# Altium project 地震波采集系统.PrjPcb
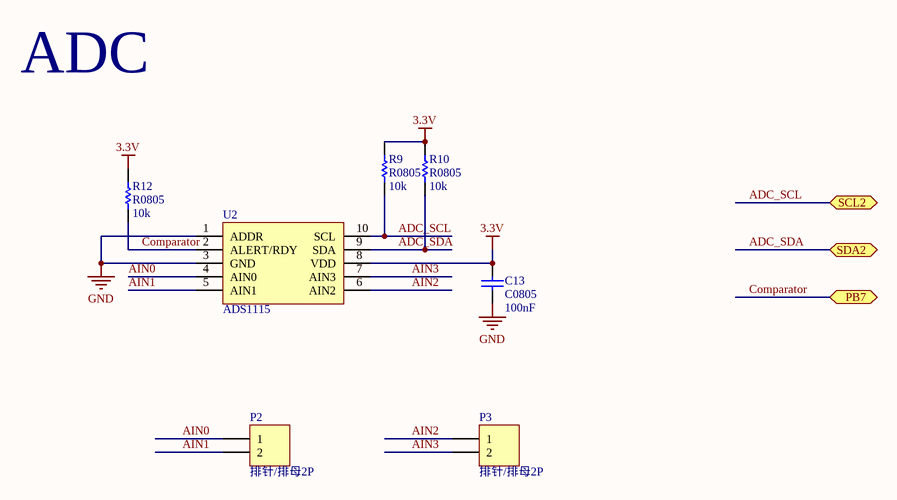
[diagram p0: ADC.SchDoc]
3 sheets, 69 parts. Net scope: flat (ports and power ports of the same name join across sheets).
Board files: PCB1.PcbDoc, PCB2.PcbDoc
Sheets:
  ADC.SchDoc
  Controller.SchDoc
  Power.SchDoc

## Sheet ADC.SchDoc
size A4; SheetNumber: 1; SheetTotal: 3

### Parts
C13  Case/Package: C0805  [C0805_200X125X140L50N]  (hidden comment: 100nF)
P2  排针/排母2P  [HDR1X2]
P3  排针/排母2P  [HDR1X2]
R9  Case/Package: R0805  [R0805_200X125X140L50N]  (hidden comment: 10k)
R10  Case/Package: R0805  [R0805_200X125X140L50N]  (hidden comment: 10k)
R12  Case/Package: R0805  [R0805_200X125X140L50N]  (hidden comment: 10k)
U2  ADS1115  [VSSOP-10_L3.0-W3.0-P0.50-LS4.9-BL]

### Ports
PB7 (bidir), SCL2 (bidir), SDA2 (bidir)

### Nets
3.3V: C13.2 R9.2 R10.2 R12.2 U2.8(VDD)
GND: C13.1 U2.1(ADDR) U2.3(GND)
ADC_SCL: R9.1 U2.10(SCL) ; port SCL2
ADC_SDA: R10.1 U2.9(SDA) ; port SDA2
AIN0: P2.1 U2.4(AIN0)
AIN1: P2.2 U2.5(AIN1)
AIN2: P3.1 U2.6(AIN2)
AIN3: P3.2 U2.7(AIN3)
Comparator: R12.1 U2.2(ALERT/RDY) ; port PB7

### Notes on the sheet
- ADC

### Library data of the parts
C13 = Cap0805: 0805 SMT MLCC Capacitor; Voltage: 50V; Tolerance: 10%; ProductIndex: 11; Published: 8-Jun-2000; LatestRevisionDate: 17-Jul-2002; LatestRevisionNote: Re-released for DXP Platform.; PackageReference: RAD-0.3; Publisher: Altium Limited; PackageDescription: Radial Cap, Thru-Hole; 2 Leads; 0.3 in Pin Spacing; Voltage Rating: 50V; ProductType: Capacitors; Value: 100nF
P2 P3 = Header 2: Header, 2-Pin; LatestRevisionDate: 17-Jul-2002; LatestRevisionNote: Re-released for DXP Platform.; Publisher: Altium Limited
R9 R10 R12 = Res0805: 0805 SMT Resistor; Tolerance: 1%; ProductIndex: 10; Published: 8-Jun-2000; LatestRevisionDate: 17-Jul-2002; LatestRevisionNote: Re-released for DXP Platform.; PackageReference: AXIAL-0.3; Publisher: Altium Limited; PackageDescription: Axial Device, Thru-Hole; 2 Leads; 0.3 in Pin Spacing; ProductType: Resistors; Value: 10k
U2 = ADS1115: ADS111x Ultra-Small, Low-Power, I / 2C-Compatible, 860-SPS, 16-Bit ADCs / With Internal Reference, Oscillator, and Programmable Comparator; Manufacturer: TI; ProductIndex: 0; ProductType: Integrated Circuits; Case/Package: SOP10; ComponentLink1Description: Datasheet; ComponentLink1URL: https://www.ti.com/lit/ds/symlink/ads1115.pdf; Value: ADS1115

## Sheet Controller.SchDoc: 地震波采集系统
size A4; Author: Jingxiang Wang; Engineer: Jingxiang Wang; Organization: UESTC; SheetNumber: 2; SheetTotal: 3
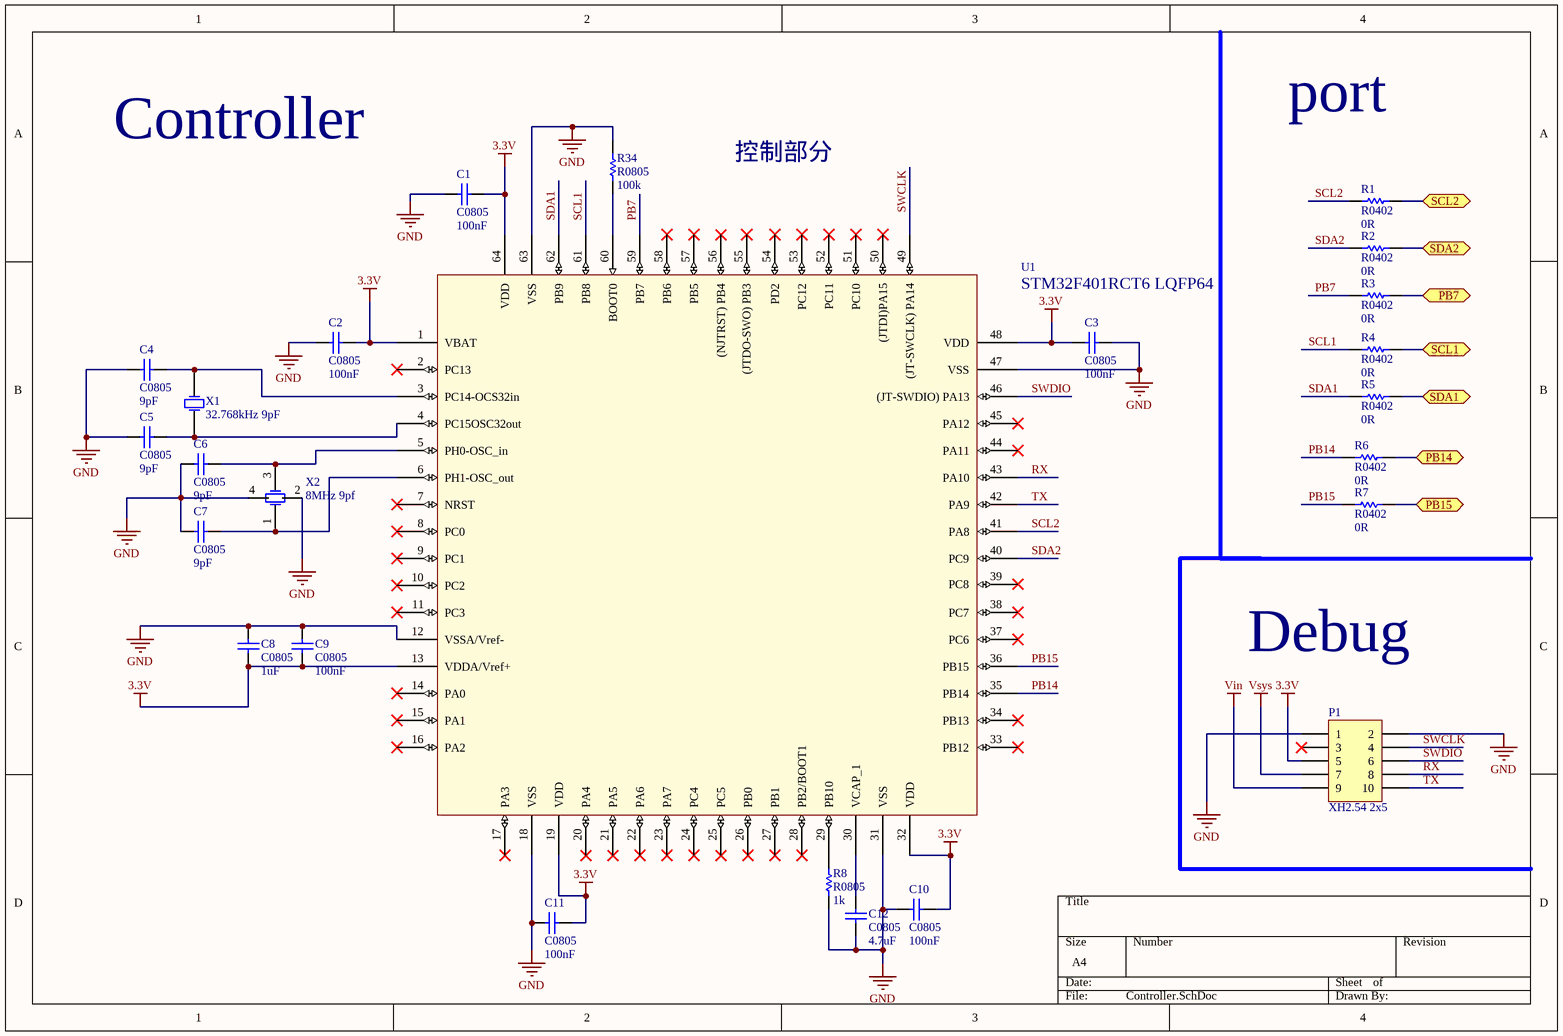
[diagram p1: Controller.SchDoc]

### Parts
C1  Case/Package: C0805  [C0805_200X125X140L50N]  (hidden comment: 100nF)
C2  Case/Package: C0805  [C0805_200X125X140L50N]  (hidden comment: 100nF)
C3  Case/Package: C0805  [C0805_200X125X140L50N]  (hidden comment: 100nF)
C4  Case/Package: C0805  [C0805_200X125X140L50N]  (hidden comment: 9pF)
C5  Case/Package: C0805  [C0805_200X125X140L50N]  (hidden comment: 9pF)
C6  Case/Package: C0805  [C0805_200X125X140L50N]  (hidden comment: 9pF)
C7  Case/Package: C0805  [C0805_200X125X140L50N]  (hidden comment: 9pF)
C8  Case/Package: C0805  [C0805_200X125X140L50N]  (hidden comment: 1uF)
C9  Case/Package: C0805  [C0805_200X125X140L50N]  (hidden comment: 100nF)
C10  Case/Package: C0805  [C0805_200X125X140L50N]  (hidden comment: 100nF)
C11  Case/Package: C0805  [C0805_200X125X140L50N]  (hidden comment: 100nF)
C12  Case/Package: C0805  [C0805_200X125X140L50N]  (hidden comment: 4.7uF)
P1  XH2.54 2x5  [HDR2X5]
R1  Case/Package: R0402  [R0402_100X50X140L30N]  (hidden comment: 0R)
R2  Case/Package: R0402  [R0402_100X50X140L30N]  (hidden comment: 0R)
R3  Case/Package: R0402  [R0402_100X50X140L30N]  (hidden comment: 0R)
R4  Case/Package: R0402  [R0402_100X50X140L30N]  (hidden comment: 0R)
R5  Case/Package: R0402  [R0402_100X50X140L30N]  (hidden comment: 0R)
R6  Case/Package: R0402  [R0402_100X50X140L30N]  (hidden comment: 0R)
R7  Case/Package: R0402  [R0402_100X50X140L30N]  (hidden comment: 0R)
R8  Case/Package: R0805  [R0805_200X125X140L50N]  (hidden comment: 1k)
R34  Case/Package: R0805  [R0805_200X125X140L50N]  (hidden comment: 100k)
U1  STM32F401RCT6_LQFP64  [STM32F401RCT6 LQFP64]  (value not drawn)
X1  Seiko SC-32S32.768kHz20PPM9pF  [Crystal Seiko 32.768kHz]  (value not drawn)
X2  #name: 8MHz 9pf  [Crystal YXC 32MHz - 3225]  (hidden comment: 8MHz 8pf 3225)

### Ports
PB7 (bidir), PB14 (bidir), PB15 (bidir), SCL1 (bidir), SCL2 (bidir), SDA1 (bidir), SDA2 (bidir)

### Nets
3.3V: C1.2 C2.2 C3.1 C8.2 C9.1 C10.2 C11.2 P1.5 U1.1(VBAT) U1.13(VDDA/Vref+) U1.19(VDD) U1.32(VDD) U1.48(VDD) U1.64(VDD)
GND: C1.1 C2.1 C3.2 C4.1 C5.1 C6.1 C7.1 C8.1 C9.2 C10.1 C11.1 C12.1 P1.1 P1.2 R8.1 R34.2 U1.12(VSSA/Vref-) U1.18(VSS) U1.31(VSS) U1.47(VSS) U1.63(VSS) X2.2(GND) X2.4(OSC2)
Vin: P1.9
Vsys: P1.7
ADC_SCL: R1.2 ; port SCL2
ADC_SDA: R2.2 ; port SDA2
CE: R7.2 ; port PB15
CHARGE_SCL: R4.2 ; port SCL1
CHARGE_SDA: R5.2 ; port SDA1
Comparator: R3.2 ; port PB7
INT: R6.2 ; port PB14
PB7: R3.1 U1.59(PB7)
PB14: R6.1 U1.35(PB14)
PB15: R7.1 U1.36(PB15)
RX: P1.8 U1.43(PA10)
SCL1: R4.1 U1.61(PB8)
SCL2: R1.1 U1.41(PA8)
SDA1: R5.1 U1.62(PB9)
SDA2: R2.1 U1.40(PC9)
SWCLK: P1.4 U1.49((JT-SWCLK)_PA14)
SWDIO: P1.6 U1.46((JT-SWDIO)_PA13)
TX: P1.10 U1.42(PA9)
NetC4_2: C4.2 U1.3(PC14-OCS32in) X1.2(OSC2)
NetC5_2: C5.2 U1.4(PC15OSC32out) X1.1(OSC1)
NetC6_2: C6.2 U1.5(PH0-OSC_in) X2.3(OSC2)
NetC7_2: C7.2 U1.6(PH1-OSC_out) X2.1(OSC1)
NetC12_2: C12.2 U1.30(VCAP_1)
NetR8_2: R8.2 U1.29(PB10)
NetR34_1: R34.1 U1.60(BOOT0)

Not connected (* = marked no-connect by the designer): P1 3*; U1 2(PC13)* 7(NRST)* 8(PC0)* 9(PC1)* 10(PC2)* 11(PC3)* 14(PA0)* 15(PA1)* 16(PA2)* 17(PA3)* 20(PA4)* 21(PA5)* 22(PA6)* 23(PA7)* 24(PC4)* 25(PC5)* 26(PB0)* 27(PB1)* 28(PB2/BOOT1)* 33(PB12)* 34(PB13)* 37(PC6)* 38(PC7)* 39(PC8)* 44(PA11)* 45(PA12)* 50((JTDI)PA15)* 51(PC10)* 52(PC11)* 53(PC12)* 54(PD2)* 55((JTDO-SWO)_PB3)* 56((NJTRST)_PB4)* 57(PB5)* 58(PB6)*

### Notes on the sheet
- Controller
- 控制部分
- port
- Debug
- (in symbol CrystalOscillator-2) 32.768kHz 9pF

### Library data of the parts
C1-C12 = Cap0805: as C13 on sheet ADC; Published: 8-Jun-2000; LatestRevisionDate: 17-Jul-2002; LatestRevisionNote: Re-released for DXP Platform.; PackageReference: RAD-0.3; Publisher: Altium Limited; PackageDescription: Radial Cap, Thru-Hole; 2 Leads; 0.3 in Pin Spacing; Voltage Rating: 50V; ProductType: Capacitors
  C1-C3 C9-C11: Value: 100nF
  C4-C7: Value: 9pF
  C8: Value: 1uF
  C12: Value: 4.7uF
P1 = Header 5X2A: Header, 5-Pin, Dual row; LatestRevisionDate: 17-Jul-2002; LatestRevisionNote: Re-released for DXP Platform.; Publisher: Altium Limited
R1-R7 = Res0402: 0402 SMT Resistor; Tolerance: 1%; ProductIndex: 10; Published: 8-Jun-2000; LatestRevisionDate: 17-Jul-2002; LatestRevisionNote: Re-released for DXP Platform.; PackageReference: AXIAL-0.3; Publisher: Altium Limited; PackageDescription: Axial Device, Thru-Hole; 2 Leads; 0.3 in Pin Spacing; ProductType: Resistors; Value: 0R
R8 R34 = Res0805: as R9 on sheet ADC; Published: 8-Jun-2000; LatestRevisionDate: 17-Jul-2002; LatestRevisionNote: Re-released for DXP Platform.; PackageReference: AXIAL-0.3; Publisher: Altium Limited; PackageDescription: Axial Device, Thru-Hole; 2 Leads; 0.3 in Pin Spacing; ProductType: Resistors
  R8: Value: 1k
  R34: Value: 100k
U1 = STM32F401RCT6_LQFP64: STM32F401RCT6 LQFP64; 1创建: 高鹏201709229; 型号说明: LQFP64 10*10mm; 2修改: *; name: STM32F401RCT6 LQFP64
X1 = CrystalOscillator-2: 晶振-2脚; 创建: 高鹏20160422
X2 = CrystalOscillator-4: 晶振-4脚; 1创建: 高鹏20171028; 2修改: *

## Sheet Power.SchDoc
size A4; SheetNumber: 3; SheetTotal: 3
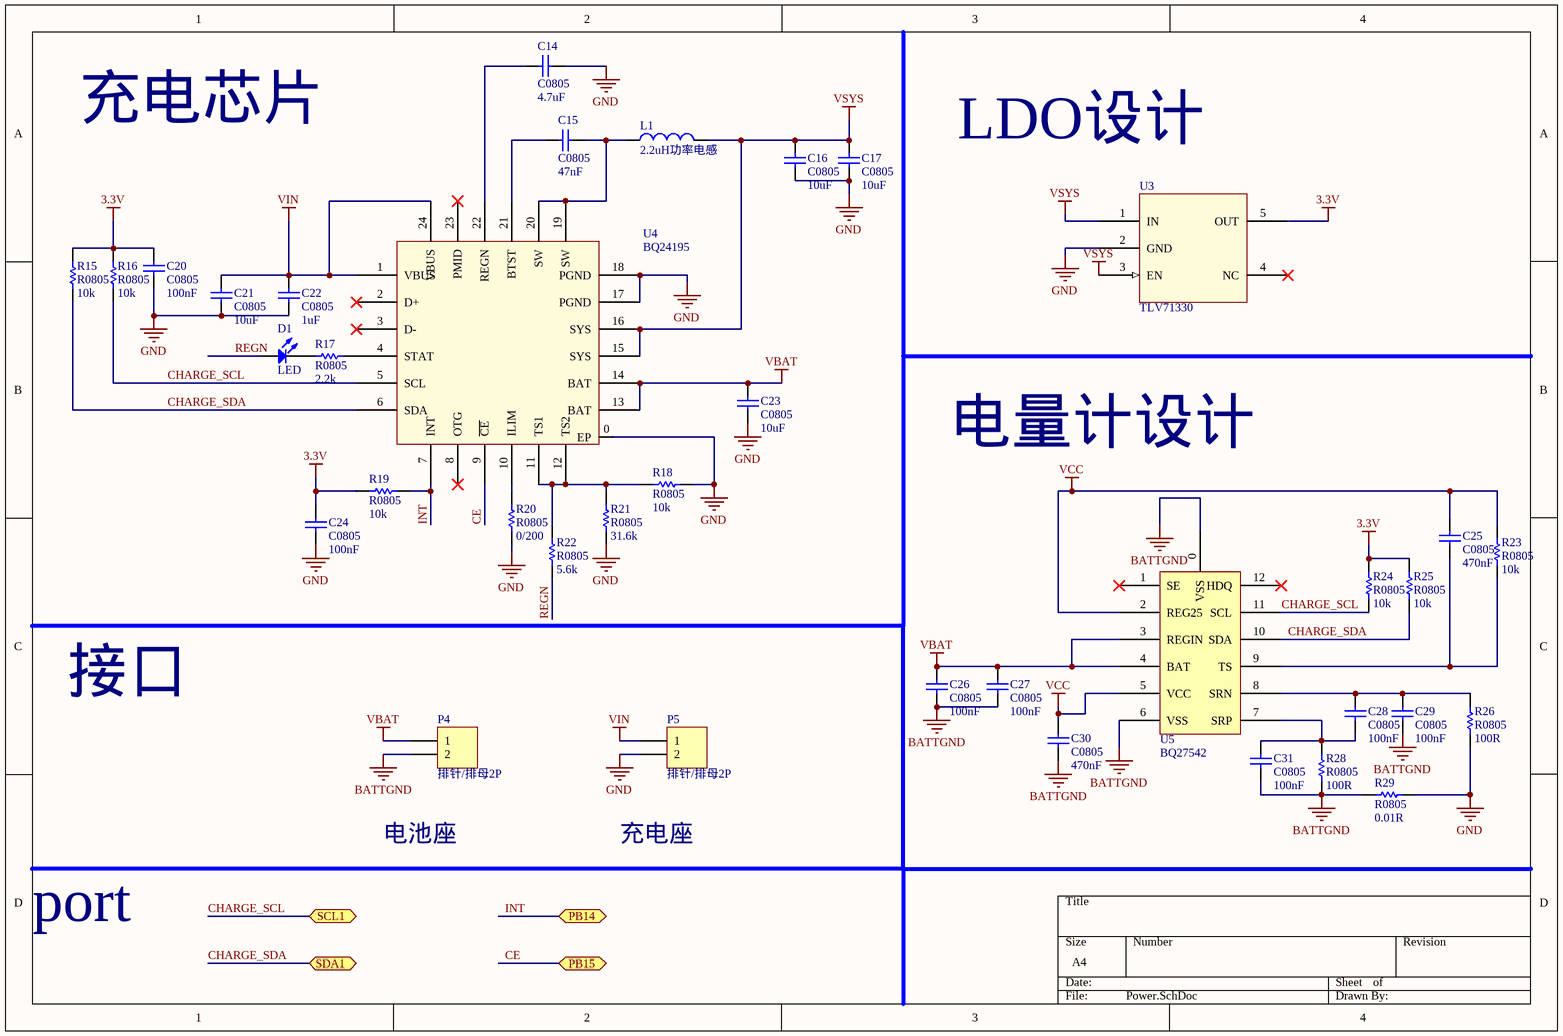
[diagram p2: Power.SchDoc]

### Parts
C14  Case/Package: C0805  [C0805_200X125X140L50N]  (hidden comment: 4.7uF)
C15  Case/Package: C0805  [C0805_200X125X140L50N]  (hidden comment: 47nF)
C16  Case/Package: C0805  [C0805_200X125X140L50N]  (hidden comment: 10uF)
C17  Case/Package: C0805  [C0805_200X125X140L50N]  (hidden comment: 10uF)
C20  Case/Package: C0805  [C0805_200X125X140L50N]  (hidden comment: 100nF)
C21  Case/Package: C0805  [C0805_200X125X140L50N]  (hidden comment: 10uF)
C22  Case/Package: C0805  [C0805_200X125X140L50N]  (hidden comment: 1uF)
C23  Case/Package: C0805  [C0805_200X125X140L50N]  (hidden comment: 10uF)
C24  Case/Package: C0805  [C0805_200X125X140L50N]  (hidden comment: 100nF)
C25  Case/Package: C0805  [C0805_200X125X140L50N]  (hidden comment: 470nF)
C26  Case/Package: C0805  [C0805_200X125X140L50N]  (hidden comment: 100nF)
C27  Case/Package: C0805  [C0805_200X125X140L50N]  (hidden comment: 100nF)
C28  Case/Package: C0805  [C0805_200X125X140L50N]  (hidden comment: 100nF)
C29  Case/Package: C0805  [C0805_200X125X140L50N]  (hidden comment: 100nF)
C30  Case/Package: C0805  [C0805_200X125X140L50N]  (hidden comment: 470nF)
C31  Case/Package: C0805  [C0805_200X125X140L50N]  (hidden comment: 100nF)
D1  LED  [LED0805]
L1  2.2uH功率电感4NR4018T2R2M  [4018]  (value not drawn)
P4  排针/排母2P  [HDR1X2]
P5  排针/排母2P  [HDR1X2]
R15  Case/Package: R0805  [R0805_200X125X140L50N]  (hidden comment: 10k)
R16  Case/Package: R0805  [R0805_200X125X140L50N]  (hidden comment: 10k)
R17  Case/Package: R0805  [R0805_200X125X140L50N]  (hidden comment: 2.2k)
R18  Case/Package: R0805  [R0805_200X125X140L50N]  (hidden comment: 10k)
R19  Case/Package: R0805  [R0805_200X125X140L50N]  (hidden comment: 10k)
R20  Case/Package: R0805  [R0805_200X125X140L50N]  (hidden comment: 0/200)
R21  Case/Package: R0805  [R0805_200X125X140L50N]  (hidden comment: 31.6k)
R22  Case/Package: R0805  [R0805_200X125X140L50N]  (hidden comment: 5.6k)
R23  Case/Package: R0805  [R0805_200X125X140L50N]  (hidden comment: 10k)
R24  Case/Package: R0805  [R0805_200X125X140L50N]  (hidden comment: 10k)
R25  Case/Package: R0805  [R0805_200X125X140L50N]  (hidden comment: 10k)
R26  Case/Package: R0805  [R0805_200X125X140L50N]  (hidden comment: 100R)
R28  Case/Package: R0805  [R0805_200X125X140L50N]  (hidden comment: 100R)
R29  Case/Package: R0805  [R0805_200X125X140L50N]  (hidden comment: 0.01R)
U3  TLV71330  [SOT-23-5]
U4  BQ24195  [BQ24195 PVQFN42]
U5  BQ27542  [BQ27542-G1]

### Ports
PB14 (bidir), PB15 (bidir), SCL1 (bidir), SDA1 (bidir)

### Nets
3.3V: C20.2 C24.2 R15.2 R16.2 R19.2 R24.2 R25.2 U3.5(OUT)
BATTGND: C26.1 C27.1 C29.1 C30.1 C31.1 P4.2 R28.1 R29.2 U5.0(VSS) U5.6(VSS)
GND: C14.1 C16.1 C17.1 C20.1 C21.1 C22.1 C23.1 C24.1 P5.2 R18.2 R20.2 R21.2 R26.1 R29.1 U3.2(GND) U4.0(EP) U4.17(PGND) U4.18(PGND)
VBAT: C23.2 C26.2 C27.2 P4.1 U4.13(BAT) U4.14(BAT) U5.3(REGIN) U5.4(BAT)
VCC: C25.2 C30.2 R23.2 U5.2(REG25) U5.5(VCC)
Vin: C21.2 C22.2 P5.1 U4.1(VBUS) U4.24(VBUS)
Vsys: C16.2 C17.2 L1.2 U3.1(IN) U3.3(EN) U4.15(SYS) U4.16(SYS)
CE: U4.9(~{CE}) ; port PB15
CHARGE_SCL: R16.1 R24.1 U4.5(SCL) U5.11(SCL) ; port SCL1
CHARGE_SDA: R15.1 R25.1 U4.6(SDA) U5.10(SDA) ; port SDA1
INT: R19.1 U4.7(INT) ; port PB14
REGN: D1.1(A) R22.2
NetC14_2: C14.2 U4.22(REGN)
NetC15_1: C15.1 L1.1 U4.19(SW) U4.20(SW)
NetC15_2: C15.2 U4.21(BTST)
NetC25_1: C25.1 R23.1 U5.9(TS)
NetC28_1: C28.1 C31.2 R28.2 U5.7(SRP)
NetC28_2: C28.2 C29.2 R26.2 U5.8(SRN)
NetD1_2: D1.2(K) R17.1
NetR17_2: R17.2 U4.4(STAT)
NetR18_1: R18.1 R21.1 R22.1 U4.11(TS1) U4.12(TS2)
NetR20_1: R20.1 U4.10(ILIM)

Not connected (* = marked no-connect by the designer): U3 4(NC)*; U4 2(D+)* 3(D-)* 8(OTG)* 23(PMID)*; U5 1(SE)* 12(HDQ)*

### Notes on the sheet
- 充电芯片
- LDO设计
- 电量计设计
- 接口
- 电池座
- 充电座
- port
- (in symbol L) 2.2uH功率电感

### Library data of the parts
C14-C17 C20-C31 = Cap0805: as C13 on sheet ADC; Published: 8-Jun-2000; LatestRevisionDate: 17-Jul-2002; LatestRevisionNote: Re-released for DXP Platform.; PackageReference: RAD-0.3; Publisher: Altium Limited; PackageDescription: Radial Cap, Thru-Hole; 2 Leads; 0.3 in Pin Spacing; Voltage Rating: 50V; ProductType: Capacitors
  C14: Value: 4.7uF
  C15: Value: 47nF
  C16 C17 C21 C23: Value: 10uF
  C20 C24 C26-C29 C31: Value: 100nF
  C22: Value: 1uF
  C25 C30: Value: 470nF
D1 = LED: Typical RED, GREEN, YELLOW, AMBER GaAs LED; Published: 8-Jun-2000; LatestRevisionDate: 17-Jul-2002; LatestRevisionNote: Re-released for DXP Platform.; PackageDocument: Feb-2002; PackageReference: 3.2X1.6X1.1; Publisher: Altium Limited; UnitPrice: 0.05
L1 = L: 电感; 创建: 高鹏20160422
P4 P5 = Header 2: Header, 2-Pin; LatestRevisionDate: 17-Jul-2002; LatestRevisionNote: Re-released for DXP Platform.; Publisher: Altium Limited
R15-R26 R28 R29 = Res0805: as R9 on sheet ADC; Published: 8-Jun-2000; LatestRevisionDate: 17-Jul-2002; LatestRevisionNote: Re-released for DXP Platform.; PackageReference: AXIAL-0.3; Publisher: Altium Limited; PackageDescription: Axial Device, Thru-Hole; 2 Leads; 0.3 in Pin Spacing; ProductType: Resistors
  R15 R16 R18 R19 R23-R25: Value: 10k
  R17: Value: 2.2k
  R20: Value: 0/200
  R21: Value: 31.6k
  R22: Value: 5.6k
  R26 R28: Value: 100R
  R29: Value: 0.01R
U3 = TLV71330: TLV713 Capacitor-Free, 150-mA, Low-Dropout Regulator / With Foldback Current Limit for Portable Devices; Manufacturer: Analog Devices; ProductIndex: 0; ProductType: Integrated Circuits; Case/Package: SOT-23; Value: TLV71330
U4 = BQ24195: bq2419x I / 2C Controlled 4.5-A Single Cell USB/Adapter Charger / with Narrow VDC Power Path Management and USB OTG; Manufacturer: TI; ProductIndex: 0; ProductType: Integrated Circuits; Case/Package: QFN24; ComponentLink1Description: Datasheet; ComponentLink1URL: https://www.ti.com/lit/ds/symlink/bq24195.pdf; Value: BQ24195
U5 = BQ27542: Single Cell Li-Ion Battery Fuel Gauge for Battery Pack Integration; Manufacturer: TI; ProductIndex: Integrated Circuits; ProductType: 0; Case/Package: 非常见封装 FON?; ComponentLink1Description: Datasheet; ComponentLink1URL: https://www.ti.com/lit/ds/symlink/bq27541-v200.pdf; Value: BQ27542

## Nets that join several sheets
3.3V: ADC (5 pins), Controller (14 pins), Power (8 pins)
GND: ADC (C13.1 U2.1 U2.3), Controller (23 pins), Power (18 pins)
Vin: Controller (P1.9), Power (5 pins)
Vsys: Controller (P1.7), Power (7 pins)
ADC_SCL: ADC (R9.1 U2.10), Controller (R1.2)
ADC_SDA: ADC (R10.1 U2.9), Controller (R2.2)
CE: Controller (R7.2), Power (U4.9)
CHARGE_SCL: Controller (R4.2), Power (R16.1 R24.1 U4.5 U5.11)
CHARGE_SDA: Controller (R5.2), Power (R15.1 R25.1 U4.6 U5.10)
Comparator: ADC (R12.1 U2.2), Controller (R3.2)
INT: Controller (R6.2), Power (R19.1 U4.7)